# EAGLE design NodeUSB_iso (EAGLE 4.16)
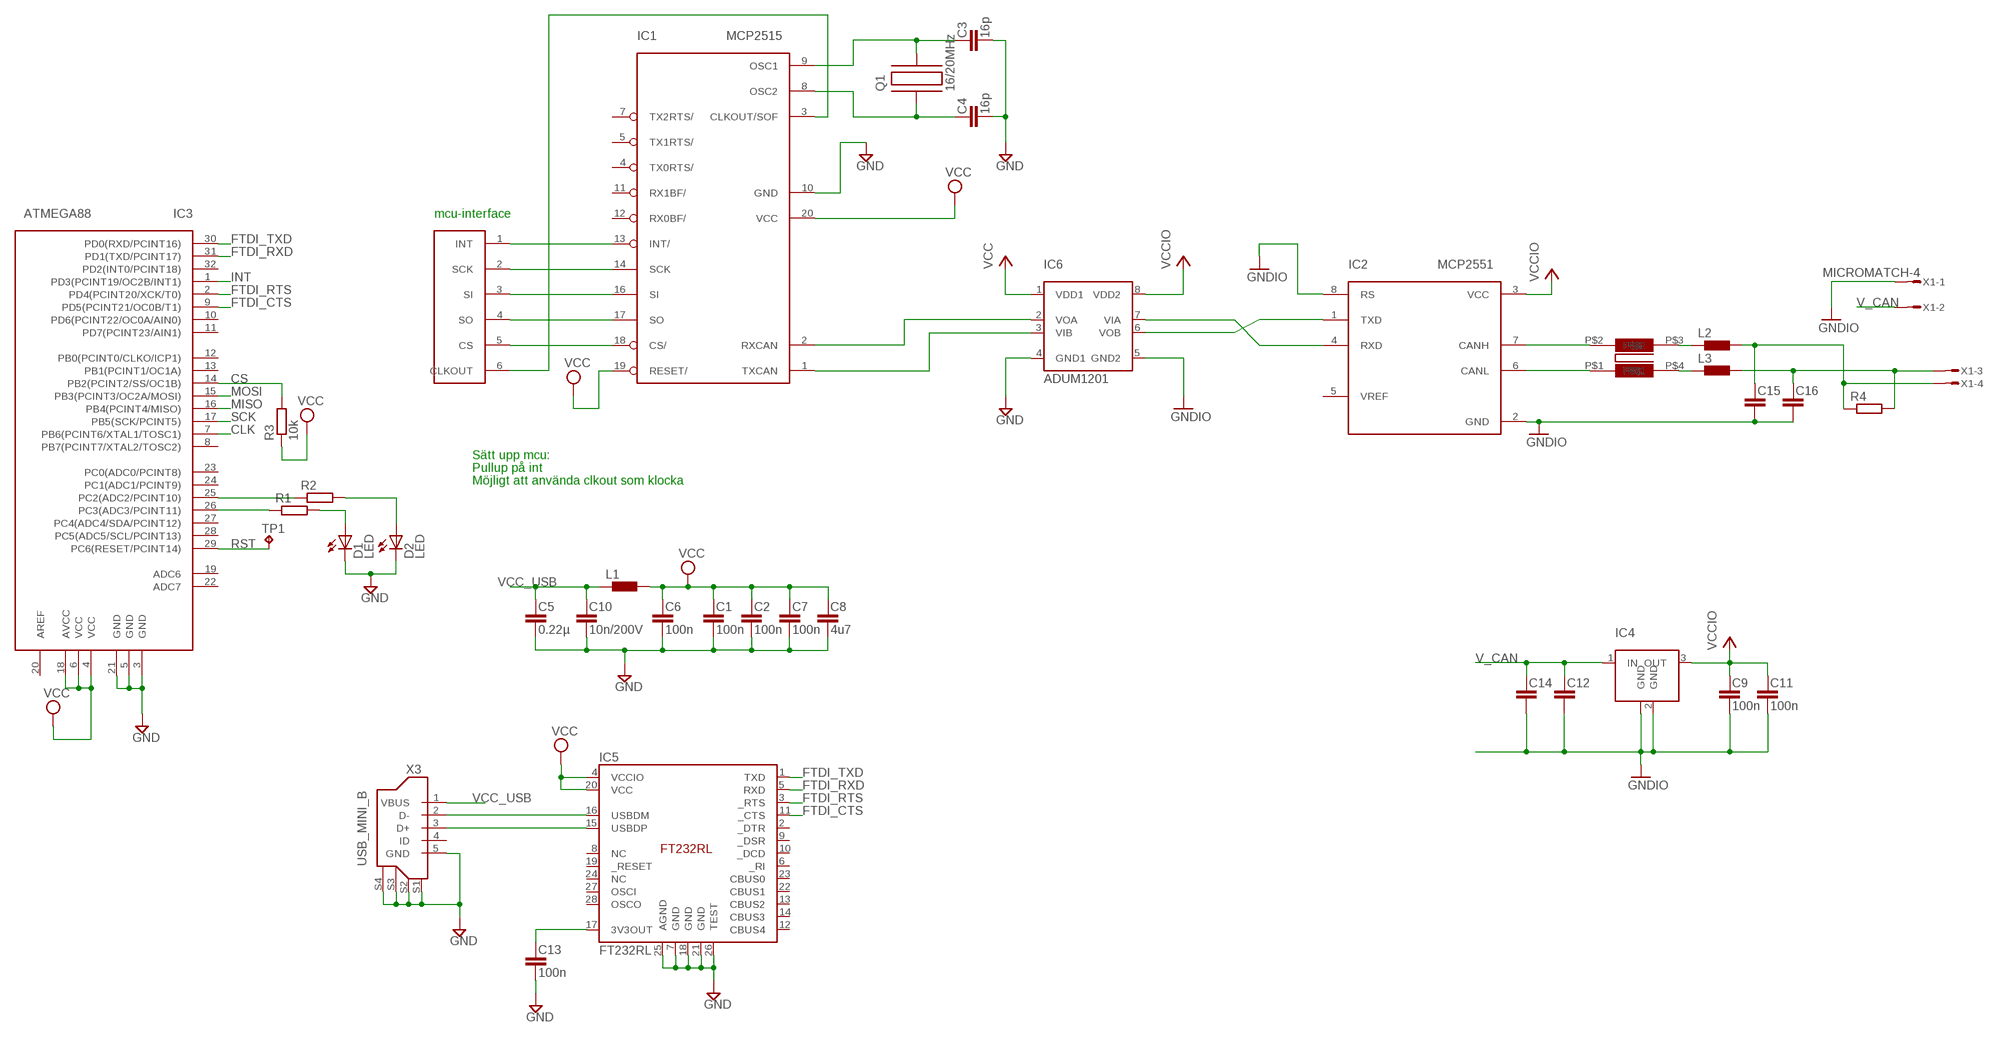
[diagram p0: schematic, sheet 1]

## Parts
C1  100n  C-EUC0603  [C0603]
C2  100n  C-EUC0603  [C0603]
C3  16p  C-EUC0603  [C0603]
C4  16p  C-EUC0603  [C0603]
C5  0.22µ  C-EUC0603  [C0603]
C6  100n  C-EUC0603  [C0603]
C7  100n  C-EUC0603  [C0603]
C8  4u7  C-EUC0603  [C0603]
C9  100n  C-EUC0603  [C0603]
C10  10n/200V  C-EUC0603  [C0603]
C11  100n  C-EUC0603  [C0603]
C12  C-EUC0603  [C0603]
C13  100n  C-EUC0603  [C0603]
C14  C-EUC0603  [C0603]
C15  C-EUC0603  [C0603]
C16  C-EUC0603  [C0603]
D1  LED  [0603]
D2  LED  [0603]
IC1  MCP2515  [TSSOP]
IC2  MCP2551  [SOIC]
IC3  ATMEGA88  [TQFP32]
IC4  LM340MP-5.0  [SOT223]
IC5  FT232RL  [SSOP-28]
IC6  ADUM1201  [SOIC]
L1  L-EUL1812  [L1812]
L2  L-EUL0603  [L0603]
L3  L-EUL0603  [L0603]
Q1  16/20MHz  C-MAC-LFA147E  [SMD]
R1  R-EUR0603  [R0603]
R2  R-EUR0603  [R0603]
R3  10k  R-EUR0603  [R0603]
R4  R-EUR0603  [R0603]
TP1  TPTP10R  [TP10R]
U$1  CAN-INTERFACE  [VIA-LIST]
U$3  B82789XN  [1812-4PAD]
X1  MICROMATCH-4  [MICROMATCH-4]
X3  USB_MINI_B  [MOLEX67503]

## Nets
CANH: C15.1 L2.2 R4.1 X1.4
CANL: C16.1 L3.2 R4.2 X1.3
CLK: IC1.3(CLKOUT/SOF) IC3.7(PB6(PCINT6/XTAL1/TOSC1)) U$1.6(CLKOUT)
CS: IC1.18(CS/) IC3.14(PB2(PCINT2/SS/OC1B)) R3.2 U$1.5(CS)
FTDI_CTS: IC3.9(PD5(PCINT21/OC0B/T1)) IC5.11(_CTS)
FTDI_RTS: IC3.2(PD4(PCINT20/XCK/T0)) IC5.3(_RTS)
FTDI_RXD: IC3.31(PD1(TXD/PCINT17)) IC5.5(RXD)
FTDI_TXD: IC3.30(PD0(RXD/PCINT16)) IC5.1(TXD)
GND: C1.2 C2.2 C3.2 C4.2 C5.2 C6.2 C7.2 C8.2 C10.2 C13.2 D1.C D2.C IC1.10(GND) IC3.3(GND) IC3.5(GND) IC3.21(GND) IC5.7(GND) IC5.18(GND) IC5.21(GND) IC5.25(AGND) IC5.26(TEST) X3.5(GND) X3.S1 X3.S2 X3.S3 X3.S4
GND1: IC6.4(GND1) ; supply symbol labelled GND
GNDIO: C9.2 C11.2 C12.2 C14.2 C15.2 C16.2 IC2.2(GND) IC2.8(RS) IC4.2(GND) IC4.4(GND) IC6.5(GND2) X1.1
INT: IC1.13(INT/) IC3.1(PD3(PCINT19/OC2B/INT1)) U$1.1(INT)
MISO: IC1.17(SO) IC3.16(PB4(PCINT4/MISO)) U$1.4(SO)
MOSI: IC1.16(SI) IC3.15(PB3(PCINT3/OC2A/MOSI)) U$1.3(SI)
N$1: IC2.7(CANH) U$3.P$2
N$2: IC2.6(CANL) U$3.P$1
N$3: IC3.26(PC3(ADC3/PCINT11)) R1.1
N$4: D1.A R1.2
N$5: IC3.25(PC2(ADC2/PCINT10)) R2.1
N$6: IC2.1(TXD) IC6.6(VOB)
N$7: C13.1 IC5.17(3V3OUT)
N$8: IC2.4(RXD) IC6.7(VIA)
N$9: IC1.2(RXCAN) IC6.2(VOA)
N$10: IC5.16(USBDM) X3.2(D-)
N$11: IC5.15(USBDP) X3.3(D+)
N$12: C3.1 IC1.9(OSC1) Q1.P$2
N$13: C4.1 IC1.8(OSC2) Q1.P$1
N$14: IC1.1(TXCAN) IC6.3(VIB)
N$15: D2.A R2.2
N$16: L3.1 U$3.P$4
N$17: L2.1 U$3.P$3
RST: IC3.29(PC6(RESET/PCINT14)) TP1.TP
SCK: IC1.14(SCK) IC3.17(PB5(SCK/PCINT5)) U$1.2(SCK)
V_CAN: C12.1 C14.1 IC4.1(IN) X1.2
VCC: C1.1 C2.1 C6.1 C7.1 C8.1 IC1.19(RESET/) IC1.20(VCC) IC3.4(VCC) IC3.6(VCC) IC3.18(AVCC) IC5.4(VCCIO) IC5.20(VCC) IC6.1(VDD1) L1.2 R3.1
VCC_USB: C5.1 C10.1 L1.1 X3.1(VBUS)
VCCIO: C9.1 C11.1 IC2.3(VCC) IC4.3(OUT) IC6.8(VDD2)
Unconnected: IC1.4(TX0RTS/) IC1.5(TX1RTS/) IC1.7(TX2RTS/) IC1.11(RX1BF/) IC1.12(RX0BF/) IC2.5(VREF) IC3.8(PB7(PCINT7/XTAL2/TOSC2)) IC3.10(PD6(PCINT22/OC0A/AIN0)) IC3.11(PD7(PCINT23/AIN1)) IC3.12(PB0(PCINT0/CLKO/ICP1)) IC3.13(PB1(PCINT1/OC1A)) IC3.19(ADC6) IC3.20(AREF) IC3.22(ADC7) IC3.23(PC0(ADC0/PCINT8)) IC3.24(PC1(ADC1/PCINT9)) IC3.27(PC4(ADC4/SDA/PCINT12)) IC3.28(PC5(ADC5/SCL/PCINT13)) IC3.32(PD2(INT0/PCINT18)) IC5.2(_DTR) IC5.6(_RI) IC5.8(NC) IC5.9(_DSR) IC5.10(_DCD) IC5.12(CBUS4) IC5.13(CBUS2) IC5.14(CBUS3) IC5.19(_RESET) IC5.22(CBUS1) IC5.23(CBUS0) IC5.24(NC) IC5.27(OSCI) IC5.28(OSCO) X3.4(ID)

## Notes on the sheet
- mcu-interface
- Sätt upp mcu:
- Pullup på int
- Möjligt att använda clkout som klocka

## Library data of the parts
C1-C16 = rcl:C-EU
D1 D2 = led:LED
IC1 = mcp2515:MCP2515
IC2 = mcp2551:MCP2551
IC3 = atmega88:ATMEGA88
IC4 = lm340mp:LM340MP-5.0
IC5 = ftdi4:FT232RL
IC6 = adum1201:ADUM1201
L1-L3 = rcl:L-EU
Q1 = hc49-4h-smx:C-MAC-LFA147E
R1-R4 = rcl:R-EU
TP1 = testpad:TP
U$1 = can-interface:CAN-INTERFACE
U$3 = epcos-choke:B82789XN
X1 = con-amp-micromatch:MICROMATCH-4: MicroMaTch 4 7-215464-4 / 0-215464-4 Drawing Number C-215464 DDEController.pdf
X3 = usbminib:USB_MINI_B

## Board
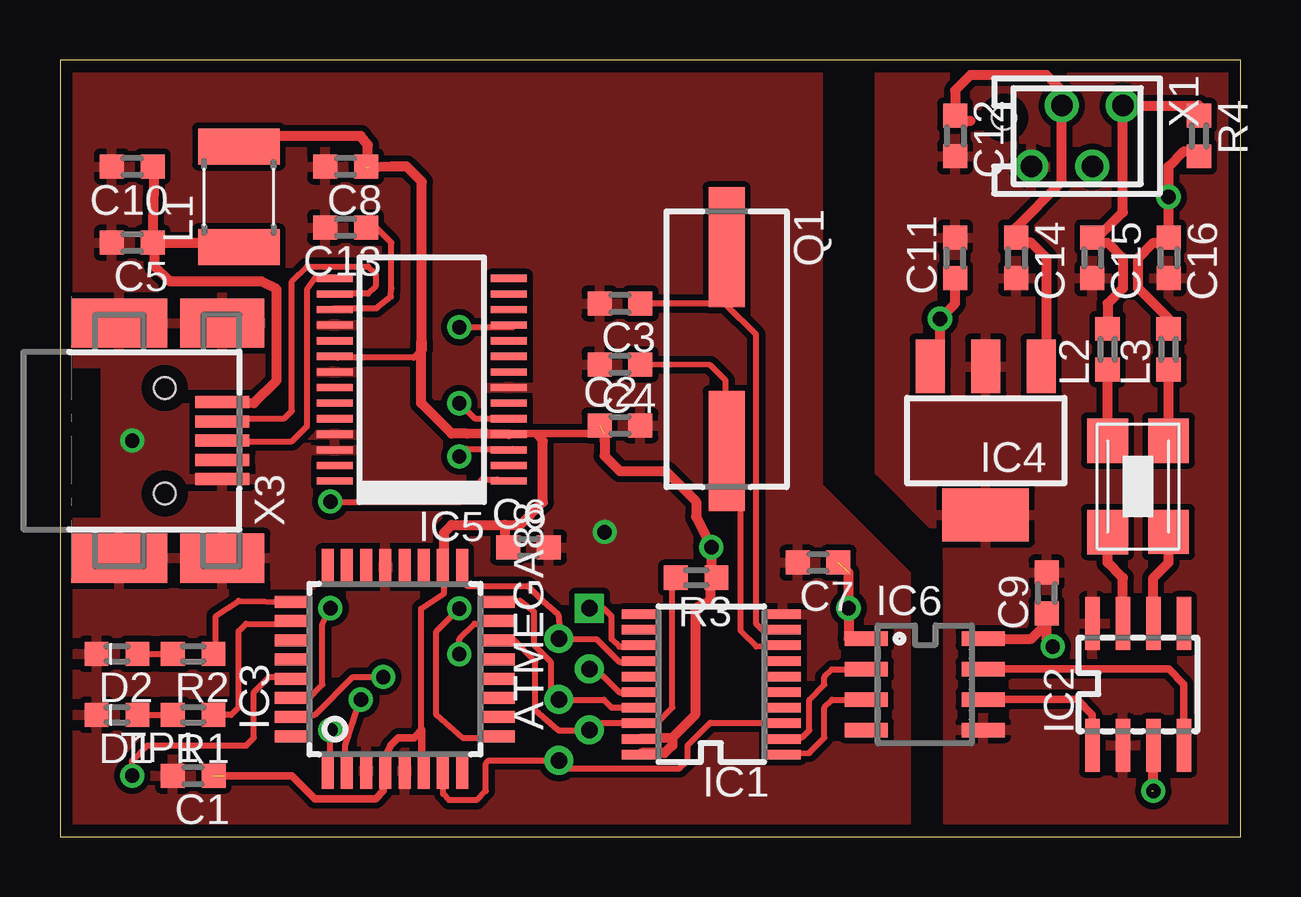
[diagram p1: board, top side]
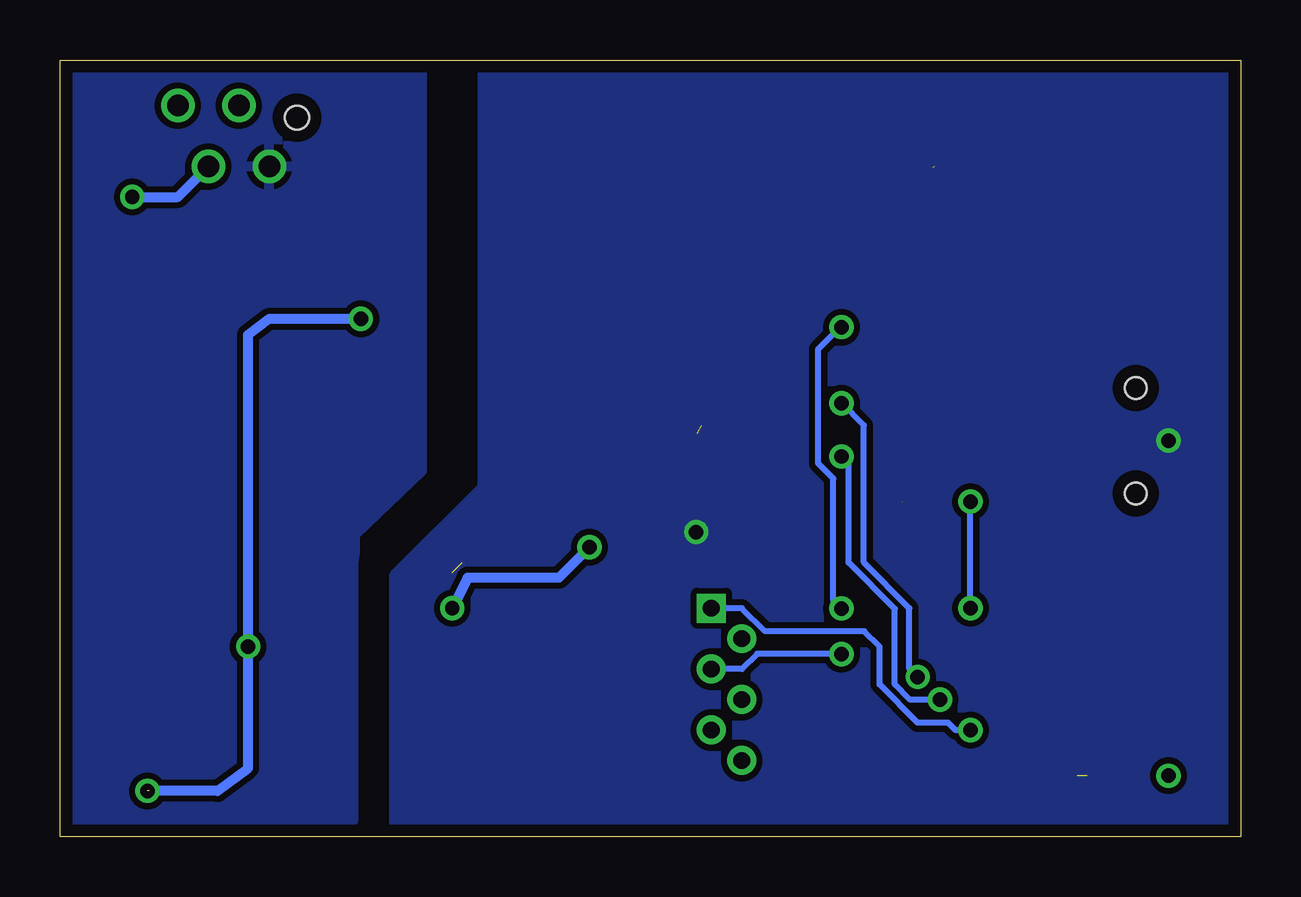
[diagram p2: board, bottom side, seen from below]

Size 49.2 x 32.38 mm. Coordinates in mm from the lower left corner, seen from the top.
Outline: 0,0 49.2,0 49.2,32.38 0,32.38 0,0
Copper layers (1*16): Top 0.035mm / dielectric 1.5mm / Bottom 0.035mm
Design rules "default": minimum track width 10mil, minimum drill 24mil, track to track 10mil, track to pad 10mil, pad to pad 10mil, via to via 10mil, smd to smd 8mil, copper to edge 20mil, drill to drill 8mil, minimum pad ring 10mil, minimum via ring 8mil, stop-mask expansion 4mil, vias tented up to drill 0mil, thermal gap 10mil

### Footprints (pad centres in the part's own frame; a part is rotated, then mirrored left to right if it is on the bottom)
C0603 = smd 1 x 1: 1 -0.85,0; 2 0.85,0
0603 = smd 0.991 x 1.016: A -0.85,0; C 0.85,0
TSSOP = smd 0.396 x 1.5: 1 -2.925,-2.975; 2 -2.275,-2.975; 3 -1.625,-2.975; 4 -0.975,-2.975; 5 -0.325,-2.975; 6 0.325,-2.975; 7 0.975,-2.975; 8 1.625,-2.975; 9 2.275,-2.975; 10 2.925,-2.975; 11 2.925,2.975; 12 2.275,2.975; 13 1.625,2.975; 14 0.975,2.975; 15 0.325,2.975; 16 -0.325,2.975; 17 -0.975,2.975; 18 -1.625,2.975; 19 -2.275,2.975; 20 -2.925,2.975
SOIC = smd 0.6 x 2.2: 1 -1.905,-2.54; 2 -0.635,-2.54; 3 0.635,-2.54; 4 1.905,-2.54; 5 1.905,2.54; 6 0.635,2.54; 7 -0.635,2.54; 8 -1.905,2.54
TQFP32 = smd 1.5 x 0.5: 1 -4.25,2.65; 2 -4.25,1.85; 3 -4.25,1.05; 4 -4.25,0.25; 5 -4.25,-0.55; 6 -4.25,-1.35; 7 -4.25,-2.15; 8 -4.25,-2.95; 17 4.25,-2.95; 18 4.25,-2.15; 19 4.25,-1.35; 20 4.25,-0.55; 21 4.25,0.25; 22 4.25,1.05; 23 4.25,1.85; 24 4.25,2.65 | smd 0.5 x 1.5: 9 -2.8,-4.4; 10 -2,-4.4; 11 -1.2,-4.4; 12 -0.4,-4.4; 13 0.4,-4.4; 14 1.2,-4.4; 15 2,-4.4; 16 2.8,-4.4; 25 2.8,4.1; 26 2,4.1; 27 1.2,4.1; 28 0.4,4.1; 29 -0.4,4.1; 30 -1.2,4.1; 31 -2,4.1; 32 -2.8,4.1
SOT223 = smd 1.219 x 2.235: 1 -2.311,-3.099; 2 0,-3.099; 3 2.311,-3.099 | smd 3.6 x 2.2: 4 0,3.099
SSOP-28 = smd 0.3 x 1.5: 1 -4.225,-3.625; 2 -3.575,-3.625; 3 -2.925,-3.625; 4 -2.275,-3.625; 5 -1.625,-3.625; 6 -0.975,-3.625; 7 -0.325,-3.625; 8 0.325,-3.625; 9 0.975,-3.625; 10 1.625,-3.625; 11 2.275,-3.625; 12 2.925,-3.625; 13 3.575,-3.625; 14 4.225,-3.625; 15 4.225,3.625; 16 3.575,3.625; 17 2.925,3.625; 18 2.275,3.625; 19 1.625,3.625; 20 0.975,3.625; 21 0.325,3.625; 22 -0.325,3.625; 23 -0.975,3.625; 24 -1.625,3.625; 25 -2.275,3.625; 26 -2.925,3.625; 27 -3.575,3.625; 28 -4.225,3.625
SOIC' = smd 0.6 x 1.8: 1 -1.905,-2.44; 2 -0.635,-2.44; 3 0.635,-2.44; 4 1.905,-2.44; 5 1.905,2.44; 6 0.635,2.44; 7 -0.635,2.44; 8 -1.905,2.44
L1812 = smd 1.5 x 3.4: 1 -2.1,0; 2 2.1,0
L0603 = smd 0.991 x 1.016: 1 -0.85,0; 2 0.85,0
SMD = smd 5 x 1.5: P$1 4.25,0; P$2 -4.25,0
R0603 = smd 0.991 x 1.016: 1 -0.85,0; 2 0.85,0
TP10R = smd 1 x 1: TP 0,0
VIA-LIST = drill 0.7 square: 1 0,2.54 | drill 0.7 round: 2 -1.27,1.27; 3 0,0; 4 -1.27,-1.27; 5 0,-2.54; 6 -1.27,-3.81
1812-4PAD = smd 1.7 x 1.85: P$1 1.268,-1.902; P$2 -1.27,-1.905; P$3 -1.27,1.905; P$4 1.27,1.905
MICROMATCH-4 = drill 0.9 round: 1 1.905,1.27; 2 0.635,-1.27; 3 -0.635,1.27; 4 -1.905,-1.27 | hole 1: 3.048,-0.762
MOLEX67503 = smd 2.25 x 0.5: 1 6.3,1.6; 2 6.3,0.8; 3 6.3,0; 4 6.3,-0.8; 5 6.3,-1.6 | smd 3.5 x 2.05: S1 6.3,4.9; S2 6.3,-4.9 | smd 4 x 2.05: S3 2,4.9; S4 2,-4.9 | hole 0.9: 3.9,2.2; 3.9,-2.2

### Placement (x,y rotation side)
C1  5.55,2.54 180 top
C2  23.33,17.14 0 top
C3  23.33,22.22 180 top
C4  23.33,19.68 180 top
C5  3.01,24.76 180 top
C6  19.52,12.06 0 top
C7  31.58,11.42 180 top
C8  11.9,27.94 180 top
C9  41.11,10.15 90 top
C10  3.01,27.94 180 top
C11  37.3,24.12 90 top
C12  37.3,29.21 270 top
C13  11.9,25.39 180 top
C14  39.84,24.12 270 top
C15  43.02,24.12 270 top
C16  46.19,24.12 270 top
D1  2.38,5.08 180 top
D2  2.38,7.62 180 top
IC1  27.14,6.34 90 top
IC2  44.92,6.34 0 top
IC3  13.81,6.98 90 top
IC4  38.57,16.51 180 top
IC5  15.08,19.05 90 top
IC6  ADUM1201  [SOIC']  36.03,6.34 270 top
L1  7.46,26.67 90 top
L2  43.65,20.32 90 top
L3  46.19,20.32 90 top
Q1  27.77,20.32 270 top
R1  5.55,5.08 180 top
R2  5.55,7.62 180 top
R3  26.5,10.79 180 top
R4  47.46,29.21 270 top
TP1  3.01,2.54 0 top
U$1  22.06,6.98 0 top
U$3  44.92,14.6 0 top
X1  42.38,29.21 180 top
X3  0.47,16.51 0 top

### Tracks (layer width: path | path; a pad name or v marks a point on that pad's centre or on a via)
CANH
  Top 0.406: L2.2 43.65,22.22 44.28,22.86 44.28,24.12 43.65,24.76 43.02,24.76 | C15.1 43.02,24.76 | 43.02,24.76 44.28,26.03 X1.4 47.46,30.48 R4.1
CANL  (via drill 0.6)
  Top 0.406: L3.2 46.19,21.59 44.92,22.86 44.92,24.12 45.55,24.76 46.19,24.76 C16.1 v46.19,26.67 46.19,27.94 46.82,28.57 47.46,28.57 R4.2
  Bottom 0.406: X1.3 44.28,26.67 v46.19,26.67
CLK
  Top 0.254: 29.63,4.75 IC1.3 30.14,4.75 | 30.14,4.75 30.27,4.75 | 30.14,4.75 27.1,4.75 26.15,3.8 26.15,3.17 25.83,2.85 21.07,2.85 21.07,2.89 U$1.6 17.87,3.17 17.74,3.04 17.74,1.9 17.36,1.52 16.22,1.52 15.96,1.77 15.96,2.72 IC3.7
CS
  Top 0.254: R3.2 25.51,10.77 25.51,5.38 24.88,4.75 IC1.18 24.13,4.75 22.37,4.75 U$1.5 22.05,4.43 20.76,4.43 19.81,5.26 19.81,7.29 18.86,8.24 18.26,8.24 IC3.14
FTDI_CTS  (via drill 0.6)
  Top 0.254: v16.64,9.51 15.69,8.56 15.69,5.07 16.77,4.12 17.72,4.12 17.79,4.19 IC3.9 | IC5.11 18.86,21.23 v16.64,21.23
  Bottom 0.254: v16.64,9.51 16.98,9.84 16.98,14.92 17.61,15.55 17.61,20.32 16.98,20.95 v16.64,21.23
FTDI_RTS  (via drill 0.6)
  Top 0.254: IC3.2 11.88,3.17 11.88,3.8 12.2,4.75 12.52,5.7 | IC5.3 18.86,16.16 16.95,16.16 v16.64,15.84 | 12.52,5.7 v12.53,5.7 v12.54,5.71 | 12.52,5.7 12.52,5.38
  Bottom 0.254: v16.64,15.84 16.34,15.55 16.34,11.42 14.42,9.5 14.42,6.33 13.78,5.7 v12.53,5.7 | v12.53,5.7 12.52,5.7 | v12.54,5.71 v12.53,5.7
FTDI_RXD  (via drill 0.6)
  Top 0.254: IC3.31 10.63,5.08 12.2,6.65 v13.47,6.65 | IC5.5 18.86,17.43 17.27,17.43 v16.64,18.06 v16.64,18.07
  Bottom 0.254: v13.47,6.65 13.81,6.98 13.81,9.52 15.71,11.42 15.71,17.14 v16.64,18.07
FTDI_TXD  (via drill 0.6)  (1 unrouted)
  Top 0.254: IC5.1 18.22,14.89 17.59,14.89 16.64,13.94 14.1,13.94 | IC3.30 10.3,5.7 10.93,6.34 10.93,8.87 v11.27,9.52 | 14.1,13.94 12.83,13.95 11.25,13.95 v11.27,13.96
  Bottom 0.254: v11.27,9.52 v11.27,13.96
GND  (via drill 0.6)
  other vias: 3.01,16.51 22.7,12.69
  pour Top: 0.47,32.38 0.47,-0.01 35.27,-0.13 35.27,10.92 31.58,14.6 31.58,32.38
  pour Bottom: -0.17,32.38 0.47,31.75 0.47,-0.01 35.27,-0.26 35.27,10.92 31.58,14.6 31.58,33.02
GNDIO
  pour Top: 34.12,32.38 34.12,15.23 36.54,12.82 36.92,12.38 36.98,11.42 36.98,0.63 49.37,0.63 49.37,32.38
  pour Bottom: 34.12,32.38 34.12,15.23 36.92,12.57 36.92,11.87 36.98,11.42 36.98,0.63 48.73,0.63 48.73,32.38
INT  (via drill 0.6)
  Top 0.254: IC3.1 11.27,2.54 v11.27,4.44 | IC1.13 24.11,7.92 23.29,7.92 22.98,8.24 22.98,9.19 22.66,9.5 22.04,9.5 | 22.04,9.5 22.03,9.5 | U$1.1 22.04,9.5
  Bottom 0.254: U$1.1 20.79,9.52 | 20.79,9.52 | 20.79,9.52 19.81,8.56 15.69,8.56 15.05,7.92 15.05,6.33 13.47,4.75 12.2,4.75 11.88,4.43 11.26,4.43 | 11.26,4.43 11.25,4.43 | v11.27,4.44 11.26,4.43
MISO
  Top 0.254: 18.54,9.82 IC3.16 18.25,9.82 19.17,9.82 19.74,9.38 19.74,7.98 20.44,7.29 20.44,6.06 U$1.4 | IC1.17 24.15,5.38 22.98,5.38 22.66,5.7 U$1.4 | U$1.4 20.76,5.7
MOSI  (via drill 0.6)
  Top 0.254: IC3.15 18.1,8.87 17.27,8.87 16.64,8.24 v16.64,7.61 | IC1.16 23.29,6.02 22.34,6.97 22.05,6.97 | 22.05,6.97 22.03,6.97 | U$1.3 22.05,6.97
  Bottom 0.254: v16.65,7.62 v16.64,7.61 16.63,7.62 | U$1.3 20.79,6.98 20.15,7.62 16.63,7.62 | 16.63,7.62 16.34,7.62
N$1
  Top 0.406: IC2.7 44.28,10.79 43.65,11.42 U$3.P$2
N$2
  Top 0.406: IC2.6 45.55,10.79 46.19,11.42 U$3.P$1
N$3
  Top 0.254: IC3.26 9.03,8.87 7.76,8.87 7.44,8.55 7.44,6.02 7.46,6.01 7.46,5.71 7.44,5.7 7.44,5.38 7.13,5.07 6.17,5.07 R1.1
N$4
  Top 0.254: D1.A R1.2
N$5
  Top 0.254: IC3.25 7.44,9.82 6.49,9.19 6.49,7.6 | 6.49,7.6 R2.1 6.41,7.6 6.49,7.6
N$6
  Top 0.305: IC2.1 43.02,5.08 42.38,5.71 IC6.6
N$7
  Top 0.254: C13.1 13.17,25.39 13.81,24.76 13.81,22.86 13.78,22.5 13.18,22.03 11.41,22.03 IC5.17
N$8
  Top 0.305: IC2.4 46.82,6.34 46.19,6.98 IC6.7
N$9
  Top 0.254: IC1.2 30.9,4.12 31.22,4.43 31.22,5.7 31.85,6.33 31.85,6.65 32.17,6.97 33.44,6.97
  Top 0.406: 33.44,6.97 33.49,6.97 33.49,6.98 IC6.2
N$10
  Top 0.254: X3.2 7.13,17.43 9.35,17.43 9.66,17.75 9.66,23.14 10.3,23.77 12.83,23.77 13.15,23.45 13.15,22.95 12.83,22.63 12.07,22.63 IC5.16
N$11
  Top 0.254: X3.3 6.81,16.48 9.66,16.48 10.3,17.11 10.3,22.82 10.61,23.26 11.32,23.26 IC5.15
N$12
  Top 0.254: IC1.9 29.32,8.55 29,8.87 29,20.92 27.73,22.19 27.73,22.22 | Q1.P$2 27.73,24.4 27.73,22.22 | 27.73,22.22 27.77,22.22 | 27.73,22.22 C3.1
N$13
  Top 0.254: IC1.8 29,7.92 28.37,8.55 28.37,13.63 27.77,15.87 Q1.P$1 27.73,16.16 27.73,19.02 27.1,19.65 C4.1
N$14
  Top 0.254: IC1.1 31.22,3.48 31.85,4.12 31.85,5.38 32.17,5.7 32.85,5.7 33.12,5.7
  Top 0.406: 32.85,5.7 32.85,5.71 IC6.3
N$15
  Top 0.254: D2.A R2.2
N$16
  Top 0.406: U$3.P$4 L3.1
N$17
  Top 0.406: 43.65,19.68 L2.1 U$3.P$3
N$18  (via drill 0.6)
  other vias: 41.36,7.92
N$19  (via drill 0.6)
  other vias: 45.55,1.9
N$20  (via drill 0.6)
  other vias: 11.27,9.52
RST  (via drill 0.6)
  Top 0.254: IC3.29 9.63,6.65 8.71,6.65 8.08,6.02 8.08,4.12 7.76,3.8 3.64,3.8 3,3.17 TP1.TP
  other vias: 3.01,2.54
SCK
  Top 0.254: 24.2,7.29 24.24,7.29 | 24.2,7.29 IC1.14 | 24.2,7.29 23.29,7.29 22.34,8.24 20.8,8.24 U$1.2 20.8,8.87 20.76,9.25 20.12,9.82 19.49,10.46 16.95,10.46 16.64,10.77 16.64,11.11 IC3.17
V_CAN
  Top 0.406: IC4.1 41.11,20.32 41.11,24.12 40.48,24.76 39.84,24.76 C14.1 39.84,25.39 41.74,27.3 X1.2 41.74,31.11 41.11,31.75 37.94,31.75 37.3,31.11 37.3,29.84 | 37.3,29.84 37.94,29.84 | 37.3,29.84 C12.1
VCC  (via drill 0.6)  (4 unrouted)
  Top 0.254: IC3.6 15.05,3.48 15.05,9.51 16,10.14 16,11.09 IC3.18 | 15.08,20.32 14.74,19.97 11.57,19.97 IC5.20
  Top 0.305: 20.12,14.58 20.12,16.48 19.81,16.8 | 19.81,16.8 18.86,16.8 IC5.4 19.81,16.8 | 19.81,16.8 22.66,16.8 | IC3.6 15.08,2.81 15.08,4.44 14.75,4.12 14.1,4.12 13.78,3.8 13.47,3.14 IC3.4 13.47,2.64 13.47,1.9 13.15,1.58 10.61,1.58 9.66,2.53 7.03,2.53 6.81,2.53
  Top 0.406: 25.51,4.12 26.46,5.07 26.46,9.5 27.1,9.82 27.1,10.77 R3.1 27.14,10.79 v27.14,12.06 26.5,13.33 26.5,13.96 25.23,15.23 23.33,15.23 22.7,15.87 22.7,16.51 22.66,16.8 | 25.51,4.12 IC1.19 | 25.51,4.12 25.51,3.8 25.2,3.48 24.24,3.48 IC1.20 | L1.2 8.73,29.21 12.54,29.21 12.83,28.84 12.83,27.89 13.81,27.94 14.44,27.94 15.08,27.3 15.08,20.6 | 15.08,20.6 15.08,20.32 | IC5.4 16.95,16.8 16.32,16.8 15.05,18.06 15.05,20.6 15.08,20.6 | 32.85,11 v32.85,9.52 32.85,8.25 IC6.1 | IC3.18 16,11.28 16,12.67 16.32,12.99 18.54,12.99 | 18.54,12.99 19.17,12.99 20.12,13.94 20.12,16.48 | C6.1 18.54,12.19 18.54,12.99
  Bottom 0.406: v27.14,12.06 28.41,10.79 32.22,10.79 v32.85,9.52
VCC_USB
  Top 0.406: X3.1 8.08,18.06 9.03,19.02 9.03,22.82 8.39,23.14 4.59,23.14 3.96,23.77 3.96,24.72 C5.1 | L1.1 7.46,24.76 C5.1 | C10.1 3.96,27.89 C5.1
VCCIO  (via drill 0.6)  (1 unrouted)
  Top 0.406: C11.1 37.3,22.22 v36.66,21.59 36.66,19.68 IC4.3 | v41.36,7.92 41.11,8.25 C9.1 41.11,8.88 40.48,8.25 IC6.8 | 45.55,1.9 IC2.3
  Bottom 0.406: v36.66,21.59 40.48,21.59 41.36,20.92 v41.36,7.92 41.36,2.85 42.63,1.9 45.48,1.9